# EAGLE design DoorBell (EAGLE 7.2.0)
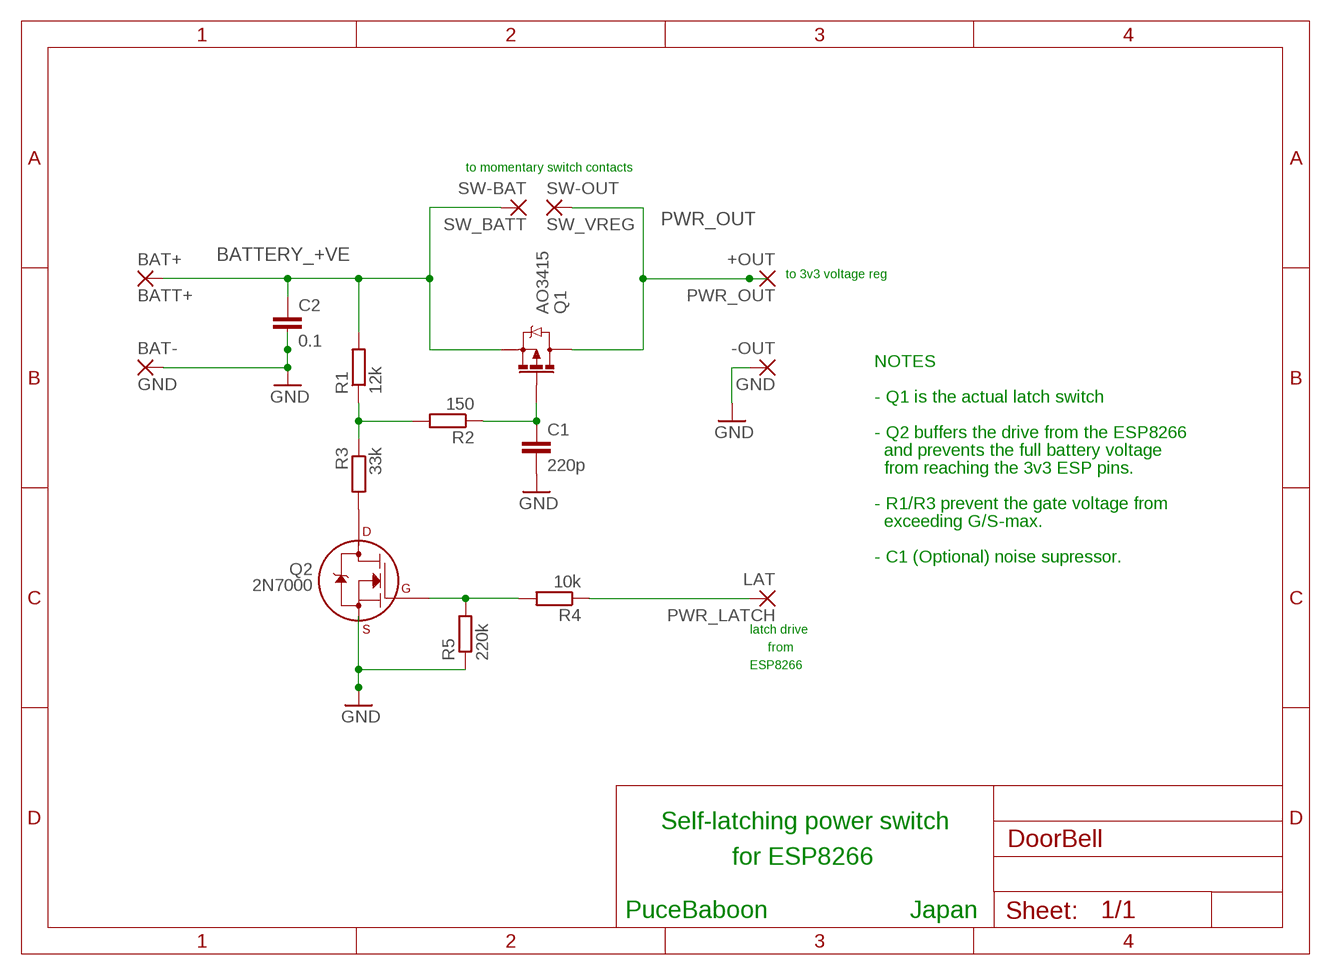
[diagram p0: schematic, sheet 1]

## Parts
+OUT  PWR_OUT  2,54/0,9  [2,54/0,9]
-OUT  GND  2,54/0,9  [2,54/0,9]
BAT+  BATT+  2,54/0,9  [2,54/0,9]
BAT-  GND  2,54/0,9  [2,54/0,9]
C1  220p  C-EU025-025X050  [C025-025X050]
C2  0.1  C-EU025-025X050  [C025-025X050]
LAT  PWR_LATCH  2,54/0,9  [2,54/0,9]
Q1  AO3415  MOSFET-PCHANNEL_SOT23-3  [SOT23-3]
Q2  2N7000  2N7000_TO92  [TO-92]
R1  12k  R-EU_0204/7  [0204/7]
R2  150  R-EU_0204/7  [0204/7]
R3  33k  R-EU_0204/7  [0204/7]
R4  10k  R-EU_0204/7  [0204/7]
R5  220k  R-EU_0204/7  [0204/7]
SW-BAT  SW_BATT  2,54/0,9  [2,54/0,9]
SW-OUT  SW_VREG  2,54/0,9  [2,54/0,9]

## Nets
BATTERY_+VE: BAT+.1(P) C2.1 Q1.2(S) R1.2 SW-BAT.1(P)
GND: -OUT.1(P) BAT-.1(P) C1.2 C2.2 Q2.1(S) R5.1
N$3: R1.1 R2.2 R3.1
N$4: C1.1 Q1.1(G) R2.1
N$5: Q2.3(D) R3.2
N$6: Q2.2(G) R4.2 R5.2
PWR_LATCH: LAT.1(P) R4.1
PWR_OUT: +OUT.1(P) Q1.3(D) SW-OUT.1(P)

## Notes on the sheet
- to momentary switch contacts
- to 3v3 voltage reg
- NOTES
- - Q1 is the actual latch switch
- - Q2 buffers the drive from the ESP8266
- and prevents the full battery voltage
- from reaching the 3v3 ESP pins.
- - R1/R3 prevent the gate voltage from
- exceeding G/S-max.
- - C1 (Optional) noise supressor.
- latch drive
- from
- ESP8266
- Self-latching power switch
- for ESP8266
- PuceBaboon | Japan

## Library data of the parts
+OUT -OUT BAT+ BAT- LAT SW-BAT SW-OUT = wirepad:2,54/0,9: THROUGH-HOLE PAD
C1 C2 = rcl:C-EU: CAPACITOR, European symbol
Q1 = Simplex-DiscreteSemi:MOSFET-PCHANNEL: Generic P-channel mosfet
Q2 = transistors_wy:2N700*: 2N7000, 2N7002, NDS7002A N-channel enhancement mode MOSFET
R1-R5 = rcl:R-EU_: RESISTOR, European symbol

## Board
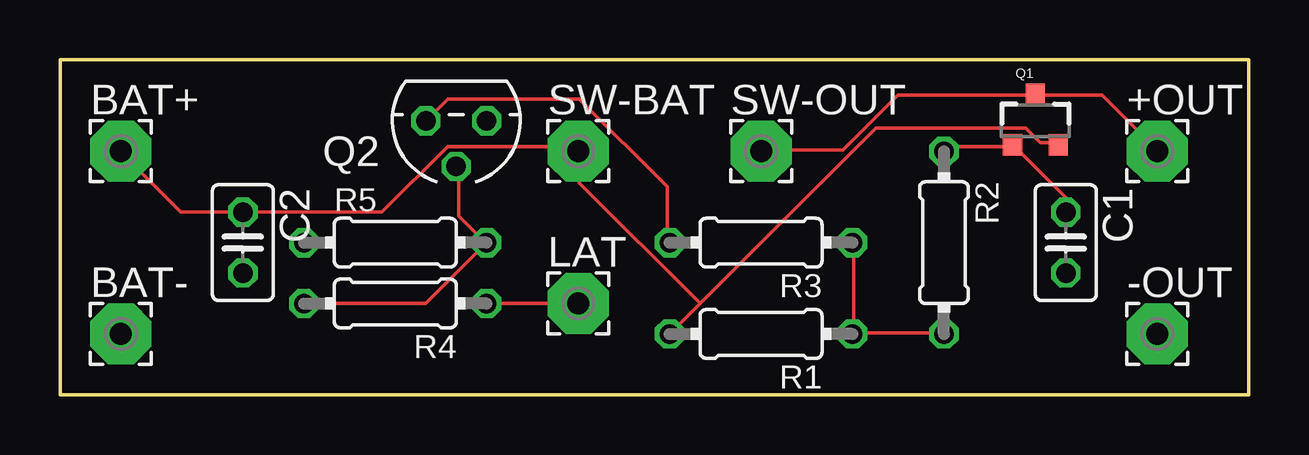
[diagram p1: board, top side]
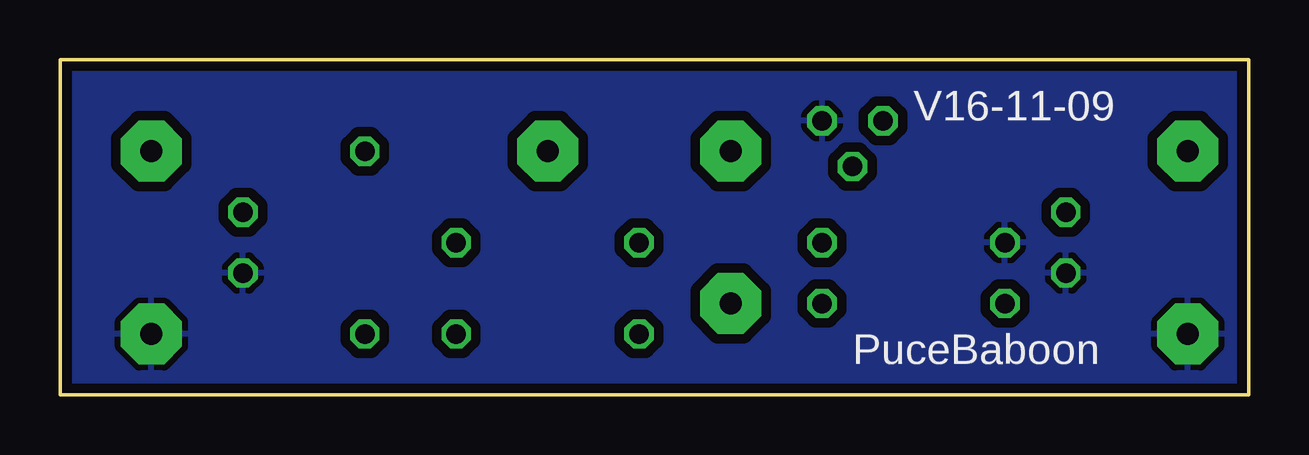
[diagram p2: board, bottom side, seen from below]

Size 49.53 x 13.97 mm. Coordinates in mm from the lower left corner, seen from the top.
Outline: 0,0 0,13.97 49.53,13.97 49.53,0 0,0
Copper layers (1*16): Top 0.0356mm / dielectric 1.5011mm / Bottom 0.0356mm
Design rules "oshpark-2layer": minimum track width 6mil, minimum drill 13mil, track to track 6mil, track to pad 6mil, pad to pad 6mil, via to via 6mil, smd to smd 6mil, copper to edge 15mil, drill to drill 6mil, minimum pad ring 7mil, minimum via ring 7mil, stop-mask expansion 2.5mil, vias tented up to drill 0mil, thermal gap 10mil

### Footprints (pad centres in the part's own frame; a part is rotated, then mirrored left to right if it is on the bottom)
2,54/0,9 = drill 0.914 pad 2.54 octagon: 1 0,0
C025-025X050 = drill 0.813 octagon: 1 -1.27,0; 2 1.27,0
SOT23-3 = smd 0.8 x 0.9: 1 -0.95,-1; 2 0.95,-1; 3 0,1.1
TO-92 = drill 0.813 octagon: 1 -1.27,0; 2 0,1.905; 3 1.27,0
0204/7 = drill 0.813 octagon: 1 -3.81,0; 2 3.81,0

### Placement (x,y rotation side)
+OUT  45.72,10.16 0 top
-OUT  45.72,2.54 0 top
BAT+  2.54,10.16 0 top
BAT-  2.54,2.54 0 top
C1  41.91,6.35 270 top
C2  7.62,6.35 270 top
LAT  21.59,3.81 0 top
Q1  40.64,11.43 0 top
Q2  16.51,11.43 180 top
R1  29.21,2.54 180 top
R2  36.83,6.35 270 top
R3  29.21,6.35 180 top
R4  13.97,3.81 180 top
R5  13.97,6.35 0 top
SW-BAT  21.59,10.16 0 top
SW-OUT  29.21,10.16 0 top

### Tracks (layer width: path | path; a pad name or v marks a point on that pad's centre or on a via)
BATTERY_+VE
  Top 0.152: BAT+.1 2.59,10.06 5.03,7.62 C2.1 13.41,7.62 16.15,10.36 21.34,10.36 21.49,10.21 SW-BAT.1 21.64,10.06 21.64,8.84 26.67,3.81 | R1.2 26.67,3.81 | 26.67,3.81 33.98,11.12 40.23,11.12 40.84,10.52 41.45,10.52 Q1.2
GND
  pour Bottom (isolate 0.406, rank 3): 0,0 0,13.97 49.53,13.97 49.53,0
N$3
  Top 0.152: 33.07,2.59 33.07,6.25 R3.1 | 33.07,2.59 36.73,2.59 R2.2 | 33.07,2.59 R1.1
N$4
  Top 0.152: R2.1 37.03,10.36 39.62,10.36 Q1.1 39.78,10.36 41.91,8.23 C1.1
N$5
  Top 0.152: Q2.3 16.15,12.34 21.64,12.34 25.3,8.69 25.3,6.4 R3.2
N$6
  Top 0.152: R4.2 15.24,3.81 R5.2 17.68,6.4 16.61,7.47 16.61,9.45 Q2.2
PWR_LATCH
  Top 0.152: LAT.1 R4.1
PWR_OUT
  Top 0.152: +OUT.1 45.72,10.21 43.43,12.5 40.69,12.5 Q1.3 40.54,12.5 34.9,12.5 32.61,10.21 29.26,10.21 SW-OUT.1

### Text on the board
_bsilk: V16-11-09 | PuceBaboon